# Altium schematic sheet [05] - Memory.SchDoc: Mantra Display Board
size A4; Author: MikrySoft; Address1: MikrySoft@gmail.com; DocumentNumber: 6; Revision: 1; SheetNumber: 6; SheetTotal: 7
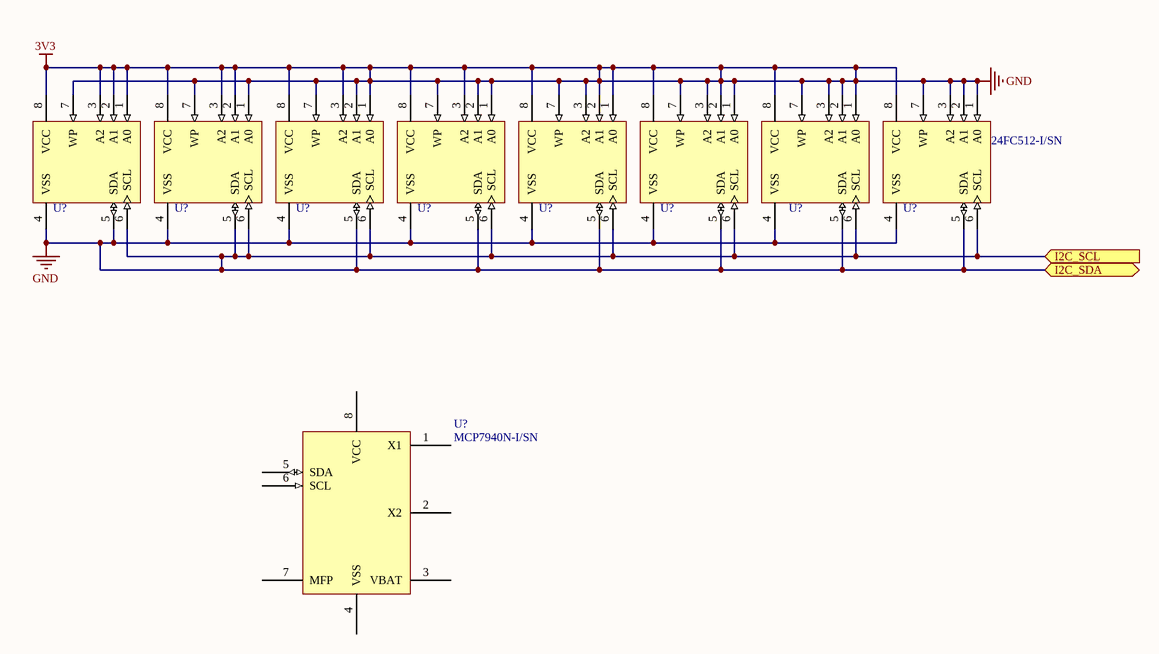
[diagram p0: [05] - Memory.SchDoc]

## Parts
(Parts that share a designator on the sheet are numbered #1, #2 ... from top to bottom, then left to right.)
U?#1  24FC512-I/SN  [MCHP-SOIC-SN8_N]  (value not drawn)
U?#2  24FC512-I/SN  [MCHP-SOIC-SN8_N]  (value not drawn)
U?#3  24FC512-I/SN  [MCHP-SOIC-SN8_N]  (value not drawn)
U?#4  24FC512-I/SN  [MCHP-SOIC-SN8_N]  (value not drawn)
U?#5  24FC512-I/SN  [MCHP-SOIC-SN8_N]  (value not drawn)
U?#6  24FC512-I/SN  [MCHP-SOIC-SN8_N]  (value not drawn)
U?#7  24FC512-I/SN  [MCHP-SOIC-SN8_N]  (value not drawn)
U?#8  24FC512-I/SN  [MCHP-SOIC-SN8_N]
U?#9  MCP7940N-I/SN  [MCP7940N-SOIC127P600X175-8N]

## Ports
I2C_SCL (in), I2C_SDA (bidir)

## Nets
3V3: U?#1.1(A0) U?#1.2(A1) U?#1.3(A2) U?#1.4(VSS) U?#1.5(SDA) U?#1.6(SCL) U?#1.7(WP) U?#1.8(VCC) U?#2.1(A0) U?#2.2(A1) U?#2.3(A2) U?#2.4(VSS) U?#2.5(SDA) U?#2.6(SCL) U?#2.7(WP) U?#2.8(VCC) U?#3.1(A0) U?#3.2(A1) U?#3.3(A2) U?#3.4(VSS) U?#3.5(SDA) U?#3.6(SCL) U?#3.7(WP) U?#3.8(VCC) U?#4.1(A0) U?#4.2(A1) U?#4.3(A2) U?#4.4(VSS) U?#4.5(SDA) U?#4.6(SCL) U?#4.7(WP) U?#4.8(VCC) U?#5.1(A0) U?#5.2(A1) U?#5.3(A2) U?#5.4(VSS) U?#5.5(SDA) U?#5.6(SCL) U?#5.7(WP) U?#5.8(VCC) U?#6.1(A0) U?#6.2(A1) U?#6.3(A2) U?#6.4(VSS) U?#6.5(SDA) U?#6.6(SCL) U?#6.7(WP) U?#6.8(VCC) U?#7.1(A0) U?#7.2(A1) U?#7.3(A2) U?#7.4(VSS) U?#7.5(SDA) U?#7.6(SCL) U?#7.7(WP) U?#7.8(VCC) U?#8.1(A0) U?#8.2(A1) U?#8.3(A2) U?#8.4(VSS) U?#8.5(SDA) U?#8.6(SCL) U?#8.7(WP) U?#8.8(VCC) ; port I2C_SCL, port I2C_SDA  [also labelled GND]

Not connected (* = marked no-connect by the designer): U?#9 1(X1) 2(X2) 3(VBAT) 4(VSS) 5(SDA) 6(SCL) 7(MFP) 8(VCC)

## Notes on the sheet
- Title
- Size:
- Date:
- A4
- Number:
- Time:
- Revision:
- Sheet
- of
- Variation:
- Author:
- E-Mail:
- File:

## Library data of the parts
U?#1-U?#8 = 24FC512-I/SN: 512K bits I2C™ Serial EEPROM, 1.7 to 5.5 V, 1 MHz, -40 to 85 degC, 8-pin SOIC (SN8), Tube; Manufacturer: Microchip; DatasheetVersion: Rev. M; PackageVersion: C04-057C; PackageReference: SOIC-SN8; PackageDescription: 8-Lead Plastic Small Outline, 4.9 x 3.9 mm Body, 1.27 mm Pitch; Supplier 1: Digi-Key; Supplier Part Number 1: 24FC512-I/SN-ND; Supplier 2: Newark; Supplier Part Number 2: 08R2176; Supplier 3: Mouser; Supplier Part Number 3: 579-24FC512-I/SN; Mounting Technology: Surface Mount; PartNumber: 24FC512-I/SN; ComponentLink1Description: Manufacturer URL; ComponentLink1URL: http://www.microchip.com; ComponentLink2Description: Datasheet; ComponentLink2URL: http://ww1.microchip.com/downloads/en/DeviceDoc/21754M.pdf; ComponentLink3Description: Package Specification; ComponentLink3URL: http://www.microchip.com/stellent/groups/techpub_sg/documents/packagingspec/en012702.pdf; ComponentLink4Description: Product URL; ComponentLink4URL: http://www.microchip.com/24FC512
U?#9 = MCP7940N-I/SN: I2C RTCC with SRAM